# Altium schematic sheet RS485.SchDoc
size A4; SheetNumber: 3; SheetTotal: 3
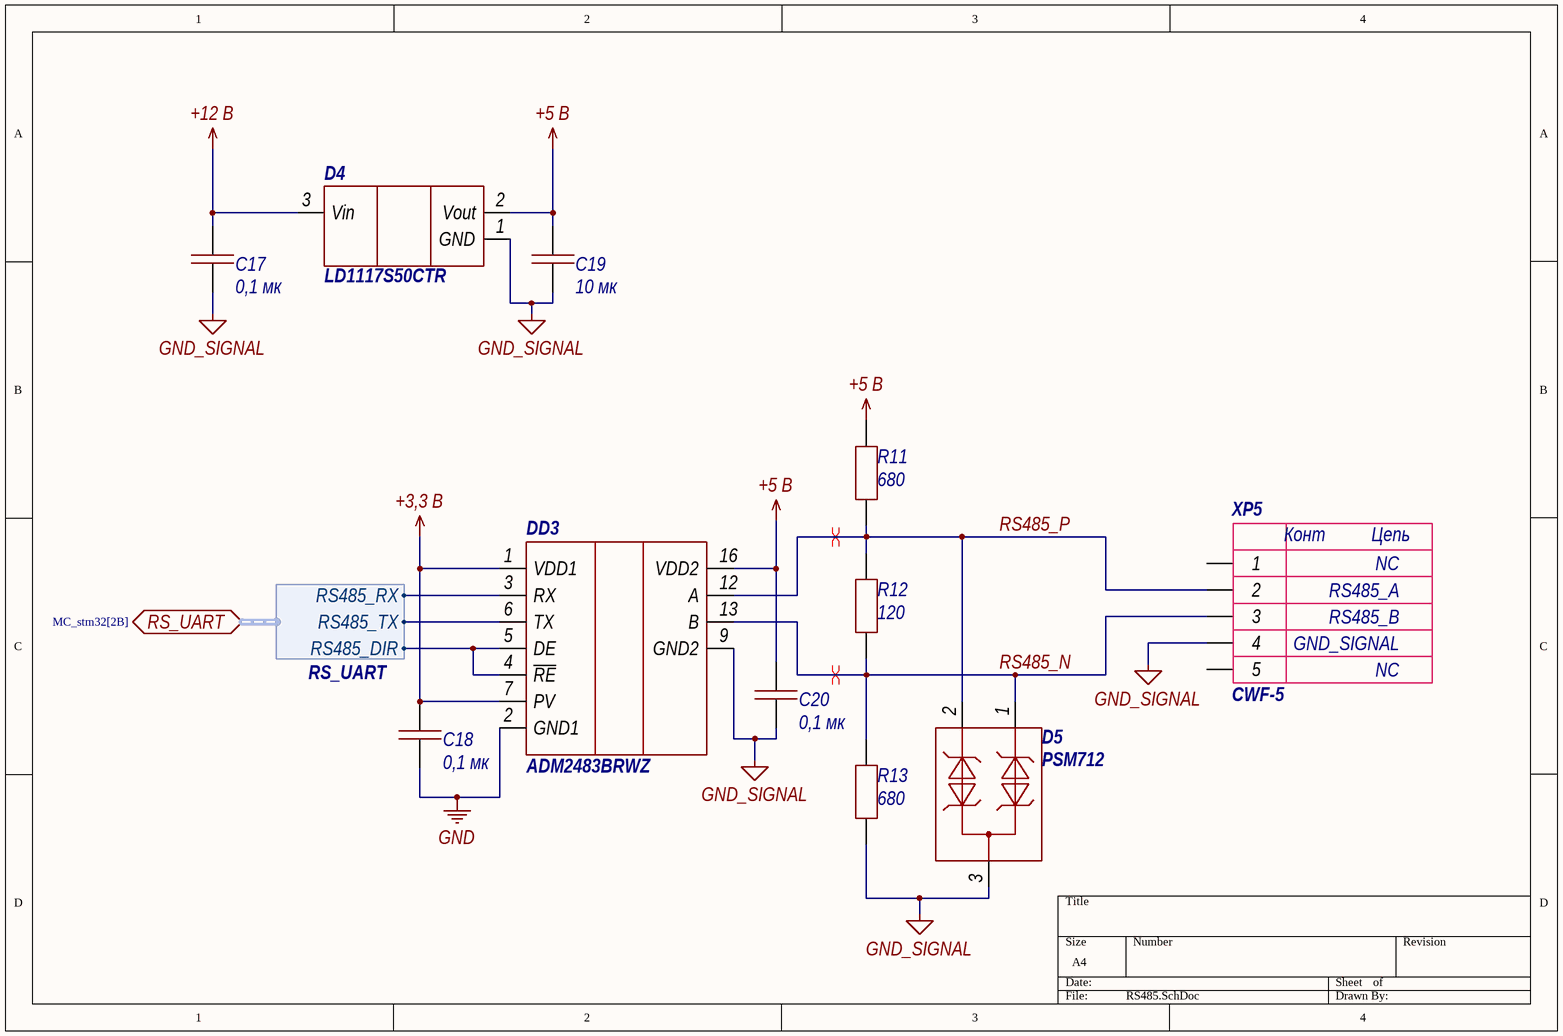
[diagram p0: RS485.SchDoc]

## Parts
C17  value 0,1 мк  [0603C]  (hidden comment: Capacitor)
C18  value 0,1 мк  [0603C]  (hidden comment: Capacitor)
C19  value 10 мк  [1210C]  (hidden comment: Capacitor)
C20  value 0,1 мк  [0603C]  (hidden comment: Capacitor)
D4  LD1117S50CTR  [SOT223]
D5  PSM712  [SOT23-3]
DD3  ADM2483BRWZ  [SOIC-16W]
R11  value 680  [0603R]  (hidden comment: Resistor)
R12  value 120  [1206R]  (hidden comment: Resistor)
R13  value 680  [0603R]  (hidden comment: Resistor)
XP5  CWF-5  Value1: NC  Value2: RS485_A  Value3: RS485_B  Value4: GND_SIGNAL  [CWF-5]

## Ports
RS_UART (bidir, harness RS_UART, see MC_stm32[2B])

## Harnesses
RS_UART: RS485_RX, RS485_TX, RS485_DIR

## Nets
+3,3 В: C18.2 DD3.1(VDD1) DD3.7(PV)
+5 В: C19.2 C20.2 D4.2(Vout) DD3.16(VDD2) R11.1
+12 В: C17.2 D4.3(Vin)
GND: C18.1 DD3.2(GND1)
GND_SIGNAL: C17.1 C19.1 C20.1 D4.1(GND) D5.3 DD3.9(GND2) R13.2 XP5.4
RS485_N: D5.1 DD3.13(B) R12.2 R13.1 XP5.3
RS485_P: D5.2 DD3.12(A) R11.2 R12.1 XP5.2
NetDD3_3: DD3.3(RX) ; port RS_UART.RS485_RX
NetDD3_4: DD3.4(~{RE}) DD3.5(DE) ; port RS_UART.RS485_DIR
NetDD3_6: DD3.6(TX) ; port RS_UART.RS485_TX

Not connected (* = marked no-connect by the designer): XP5 1 5

## Layout directives
differential pair: RS485_N, RS485_P

## Notes on the sheet
- (in symbol CWF-5) Конт; Цепь

## Library data of the parts
C17 C18 C20 = Capacitor_0,1u_10_50V_X7R_0603C: Конденсатор; Tolerance: 0,1; Voltage (V): 50; Dielectric: X7R; Capacity (nF): 100; Part Number: Capacitor_0,1u_10_50V_X7R_0603C
C19 = Capacitor_10u_10_35V_X7R_1210C: Конденсатор; Tolerance: 0,1; Voltage (V): 35; Dielectric: X7R; Capacity (nF): 10000; Part Number: Capacitor_10u_10_35V_X7R_1210C
D4 = LD1117S50CTR: Линейный стабилизатор напряжения; Part Number: LD1117S50CTR
D5 = PSM712: Защитный диод для линии RS-485; Part Number: PSM712; Interface: RS-485
DD3 = ADM2483BRWZ: Прием передатчик RS485 с гальванической развязкой; Part Number: ADM2483BRWZ
R11 R13 = Resistor_680_1_0603: Резистор номиналом 680 Ом и точностью 1%; Power: *; Part Number: Resistor_680_1_0603; Tolerance: 1%
R12 = Resistor_120_1_0603: Резистор номиналом 120 Ом и точностью 1%; Power: *; Part Number: Resistor_120_1_0603; Tolerance: 1%
XP5 = CWF-5: 5-пиновый разъем с ключом; Value5: NC; Part Number: CWF-5